# EAGLE design synth-zodiac-scorpio-kbd (EAGLE 9.6.2)
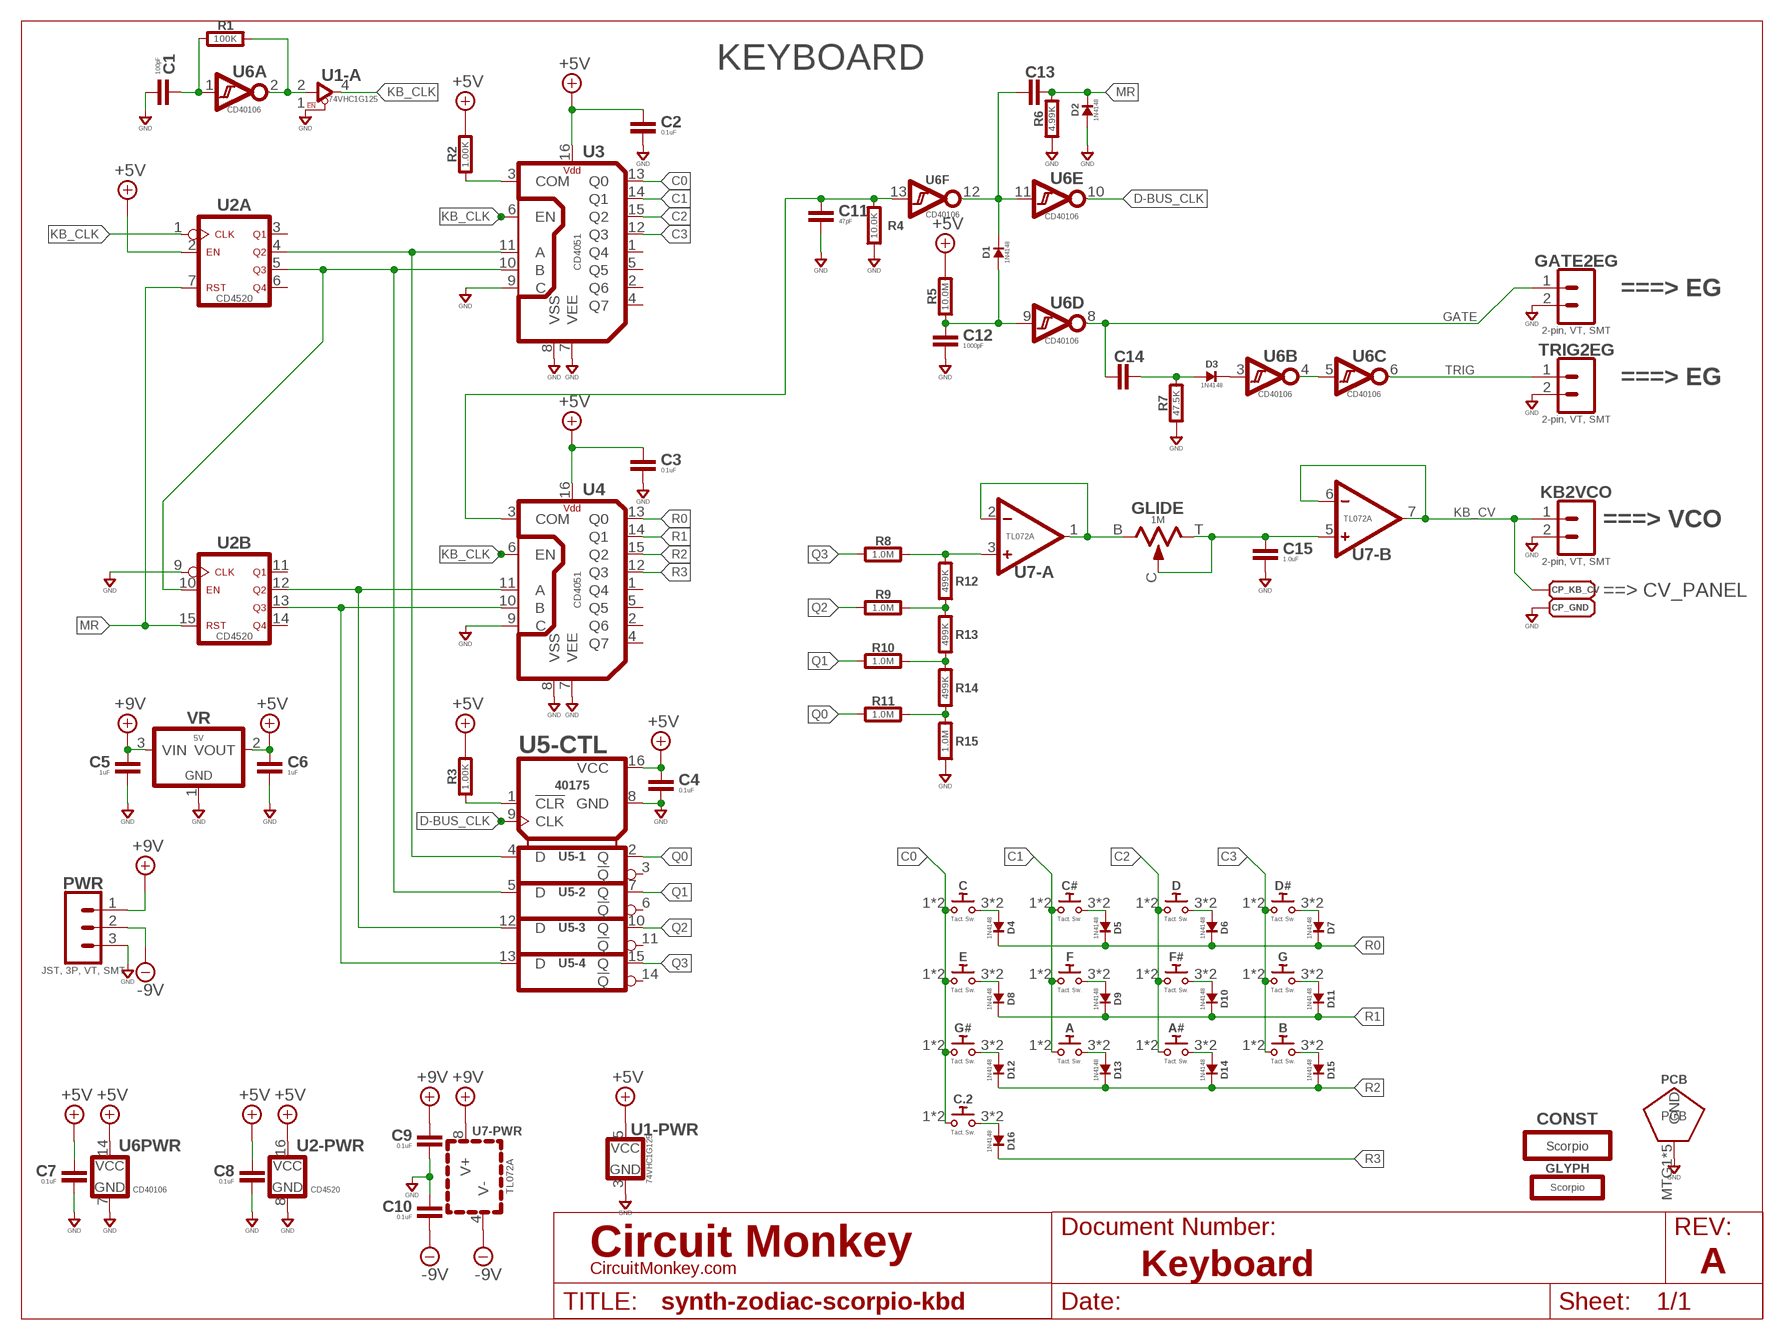
[diagram p0: schematic, sheet 1]
SHEET4 (LETTER_L-CIRCUITMONKEY): DOCUMENT_NUMBER: Keyboard; REV: A

## Parts
A  Tact. Sw.  PUSHBTN-MOMB3FS  [B3FS]
A#  Tact. Sw.  PUSHBTN-MOMB3FS  [B3FS]
B  Tact. Sw.  PUSHBTN-MOMB3FS  [B3FS]
C  Tact. Sw.  PUSHBTN-MOMB3FS  [B3FS]
C1  100pF  CAPACITOR0603  [0603-CAP]
C2  0.1uF  CAPACITOR0603  [0603-CAP]
C3  0.1uF  CAPACITOR0603  [0603-CAP]
C4  0.1uF  CAPACITOR0603  [0603-CAP]
C5  1uF  CAPACITOR0603  [0603-CAP]
C6  1uF  CAPACITOR0603  [0603-CAP]
C7  0.1uF  CAPACITOR0603  [0603-CAP]
C8  0.1uF  CAPACITOR0603  [0603-CAP]
C9  0.1uF  CAPACITOR0603  [0603-CAP]
C10  0.1uF  CAPACITOR0603  [0603-CAP]
C11  47pF  CAPACITOR0603  [0603-CAP]
C12  1000pF  CAPACITOR0603  [0603-CAP]
C13  220pF  CAPACITOR0603  [0603-CAP]
C14  0.1uF  CAPACITOR0603  [0603-CAP]
C15  1.0uF  CAPACITOR0603  [0603-CAP]
C#  Tact. Sw.  PUSHBTN-MOMB3FS  [B3FS]
C.2  Tact. Sw.  PUSHBTN-MOMB3FS  [B3FS]
CONST  Scorpio  CONSTELLATION-SCORPIO  [SCORPIO-CONST]
CP_GND  PAD-70X70SMD-070X070  [SMD-070MIL]
CP_KB_CV  PAD-70X70SMD-070X070  [SMD-070MIL]
D  Tact. Sw.  PUSHBTN-MOMB3FS  [B3FS]
D1  1N4148  DIODE-1N4148  [SOD-123]
D2  1N4148  DIODE-1N4148  [SOD-123]
D3  1N4148  DIODE-1N4148  [SOD-123]
D4  1N4148  DIODE-1N4148  [SOD-123]
D5  1N4148  DIODE-1N4148  [SOD-123]
D6  1N4148  DIODE-1N4148  [SOD-123]
D7  1N4148  DIODE-1N4148  [SOD-123]
D8  1N4148  DIODE-1N4148  [SOD-123]
D9  1N4148  DIODE-1N4148  [SOD-123]
D10  1N4148  DIODE-1N4148  [SOD-123]
D11  1N4148  DIODE-1N4148  [SOD-123]
D12  1N4148  DIODE-1N4148  [SOD-123]
D13  1N4148  DIODE-1N4148  [SOD-123]
D14  1N4148  DIODE-1N4148  [SOD-123]
D15  1N4148  DIODE-1N4148  [SOD-123]
D16  1N4148  DIODE-1N4148  [SOD-123]
D#  Tact. Sw.  PUSHBTN-MOMB3FS  [B3FS]
E  Tact. Sw.  PUSHBTN-MOMB3FS  [B3FS]
F  Tact. Sw.  PUSHBTN-MOMB3FS  [B3FS]
F#  Tact. Sw.  PUSHBTN-MOMB3FS  [B3FS]
G  Tact. Sw.  PUSHBTN-MOMB3FS  [B3FS]
G#  Tact. Sw.  PUSHBTN-MOMB3FS  [B3FS]
GATE2EG  2-pin, VT, SMT  02PVT-SMT  [B2B-PH-SM4]
GLIDE  1M  TRIMPOT9MM_PCB_SHAFT  [POT-RV9110]
GLYPH  Scorpio  GLYPH-SCORPIO  [SCORPIO-GLYPH]
KB2VCO  2-pin, VT, SMT  02PVT-SMT  [B2B-PH-SM4]
PCB  PCB FAB  PENTAGON-40R  [PENTAGON-40MM-RAD]
PWR  JST, 3P, VT, SMT  03P-VT-SMT  [B3B-PH-SM4]
R1  100K  RESISTOR0603  [0603-RES]
R2  1.00K  RESISTOR0603  [0603-RES]
R3  1.00K  RESISTOR0603  [0603-RES]
R4  10.0K  RESISTOR0603  [0603-RES]
R5  10.0M  RESISTOR0603  [0603-RES]
R6  4.99K  RESISTOR0603  [0603-RES]
R7  47.5K  RESISTOR0603  [0603-RES]
R8  1.0M  RESISTOR0603  [0603-RES]
R9  1.0M  RESISTOR0603  [0603-RES]
R10  1.0M  RESISTOR0603  [0603-RES]
R11  1.0M  RESISTOR0603  [0603-RES]
R12  499K  RESISTOR0603  [0603-RES]
R13  499K  RESISTOR0603  [0603-RES]
R14  499K  RESISTOR0603  [0603-RES]
R15  1.0M  RESISTOR0603  [0603-RES]
TRIG2EG  2-pin, VT, SMT  02PVT-SMT  [B2B-PH-SM4]
U1  74VHC1G125  74VHC1G125CMOS-SOT553  [TSOP-5]
U2  CD4520  [SO16]
U3  CD4051  CD4051SO-D  [SO16]
U4  CD4051  CD4051SO-D  [SO16]
U5  40175  CD40175SMT-D-TYPE  [SO16]
U6  CD40106  CD40106-SOP14  [SOP14]
U7  TL072A  DUALTL072A  [SOP08]
VR  5V  LDO-3P--5V-SOT23  [SOT-23]

## Nets
+5V: C2.1 C3.1 C4.1 C6.1 C7.1 C8.1 R2.2 R3.2 R5.2 U1.5(-PWR:VCC) U2.2(A:EN) U2.16(-PWR:VCC) U3.16(VDD) U4.16(VDD) U5.16(-CTL:VCC) U6.14(PWR:VCC) VR.2(VOUT)
+9V: C5.1 C9.1 PWR.1 U7.8(-PWR:V+) VR.3(VIN)
-9V: C10.2 PWR.2 U7.4(-PWR:V-)
C0: C.1 C.2 C.2.1 C.2.2 E.1 E.2 G#.1 G#.2 U3.13(Q0)
C1: A.1 A.2 C#.1 C#.2 F.1 F.2 U3.14(Q1)
C2: A#.1 A#.2 D.1 D.2 F#.1 F#.2 U3.15(Q2)
C3: B.1 B.2 D#.1 D#.2 G.1 G.2 U3.12(Q3)
D-BUS_CLK: U5.9(-CTL:CLK) U6.10(E:Y)
GATE: C14.1 GATE2EG.1 U6.8(D:Y)
GND: C1.2 C2.2 C3.2 C4.2 C5.2 C6.2 C7.2 C8.2 C9.2 C10.1 C11.2 C12.2 C15.2 CP_GND.1(PAD) D2.A GATE2EG.2 KB2VCO.2 PCB.MTG1(GND) PCB.MTG2(GND) PCB.MTG3(GND) PCB.MTG4(GND) PCB.MTG5(GND) PWR.3 R4.1 R6.1 R7.1 R15.1 TRIG2EG.2 U1.1(-A:!EN) U1.3(-PWR:GND) U2.8(-PWR:GND) U2.9(B:!CLK) U3.7(VEE) U3.8(VSS) U3.9(C) U4.7(VEE) U4.8(VSS) U4.9(C) U5.8(-CTL:GND) U6.7(PWR:GND) VR.1(GND)
KB_CLK: U1.4(-A:Y) U2.1(A:!CLK) U3.6(EN) U4.6(EN)
KB_CV: CP_KB_CV.1(PAD) KB2VCO.1 U7.6(-B:-) U7.7(-B:OUT)
MR: C13.2 D2.K R6.2 U2.7(A:RST) U2.15(B:RST)
N$78: R2.1 U3.3(COM)
N$102: C12.1 D1.A R5.1 U6.9(D:A)
N$103: R3.1 U5.1(-CTL:!CLR)
N$104: U6.4(B:Y) U6.5(C:A)
N$105: U2.12(B:Q2) U4.11(A) U5.12(-3:D)
N$106: U2.13(B:Q3) U4.10(B) U5.13(-4:D)
N$107: C1.1 R1.1 U6.1(A:A)
N$108: R1.2 U1.2(-A:A) U6.2(A:Y)
N$109: U2.4(A:Q2) U3.11(A) U5.4(-1:D)
N$110: U2.5(A:Q3) U2.10(B:EN) U3.10(B) U5.5(-2:D)
N$111: R11.2 R14.1 R15.2
N$112: C13.1 D1.K U6.11(E:A) U6.12(F:Y)
N$113: R10.2 R13.1 R14.2
N$114: D3.K U6.3(B:A)
N$115: C14.2 D3.A R7.2
N$116: C11.1 R4.2 U4.3(COM) U6.13(F:A)
N$117: R9.2 R12.1 R13.2
N$118: R8.2 R12.2 U7.3(-A:+)
N$119: GLIDE.B U7.1(-A:OUT) U7.2(-A:-)
N$120: C.3 C.4 D4.A
N$121: C15.1 GLIDE.C GLIDE.T U7.5(-B:+)
N$122: C#.3 C#.4 D5.A
N$123: D6.A D.3 D.4
N$124: D7.A D#.3 D#.4
N$125: D8.A E.3 E.4
N$126: D9.A F.3 F.4
N$127: D10.A F#.3 F#.4
N$128: D11.A G.3 G.4
N$129: D12.A G#.3 G#.4
N$130: A.3 A.4 D13.A
N$131: A#.3 A#.4 D14.A
N$132: B.3 B.4 D15.A
N$133: C.2.3 C.2.4 D16.A
Q0: R11.1 U5.2(-1:Q)
Q1: R10.1 U5.7(-2:Q)
Q2: R9.1 U5.10(-3:Q)
Q3: R8.1 U5.15(-4:Q)
R0: D4.K D5.K D6.K D7.K U4.13(Q0)
R1: D8.K D9.K D10.K D11.K U4.14(Q1)
R2: D12.K D13.K D14.K D15.K U4.15(Q2)
R3: D16.K U4.12(Q3)
TRIG: TRIG2EG.1 U6.6(C:Y)
Unconnected: U2.3(A:Q1) U2.6(A:Q4) U2.11(B:Q1) U2.14(B:Q4) U3.1(Q4) U3.2(Q6) U3.4(Q7) U3.5(Q5) U4.1(Q4) U4.2(Q6) U4.4(Q7) U4.5(Q5) U5.3(-1:!Q) U5.6(-2:!Q) U5.11(-3:!Q) U5.14(-4:!Q)

## Notes on the sheet
- KEYBOARD
- ===> EG
- ===> EG
- ===> VCO
- ==> CV_PANEL

## Library data of the parts
A A# B C C# C.2 D D# E F F# G G# = switch-smd:PUSHBTN-MOM: Pushbutton Switch; MFR: Omron; MPN: B3FS-10*
C1-C15 = rlc:CAPACITOR: Capacitor; COST01: 0.12; COST10: 0.09; COST100: 0.05
CONST = circuit-monkey-zodiac:CONSTELLATION: Constellations
CP_GND CP_KB_CV = con-testpoints:PAD-70X70: Solder Pad
D1-D16 = diodes:DIODE-: Diode; COST01: 0.20; COST10: 0.18; COST100: 0.10; MPN: 1N4148W
GATE2EG KB2VCO TRIG2EG = con-jst:02P: 2 pin connector; COST01: 0.76; COST10: 0.66; COST100: 0.56; MFR: JST; MPN: B2B-PH-SM4
GLIDE = rlc:TRIMPOT: Potentiometer; COST01: 0.70; COST10: 0.60; COST100: 0.60; MFR: Tayda; MPN: RV9110NO-OS15A00; SKU: A-5517
GLYPH = circuit-monkey-zodiac:GLYPH: Glyph
PCB = circuit-monkey-zodiac:PENTAGON: Pentagram shaped PCB
PWR = con-jst:03P: 3 pin connector; COST01: 0.60; COST10: 0.52; COST100: 0.43; MFR: JST; MPN: B3B-PH-SM4
R1-R15 = rlc:RESISTOR: Resistor; COST01: 0.10; COST10: 0.05; COST100: 0.02
U1 = logic:74VHC1G*125: Single Gate Buffer with Enable; COST01: 0.50; COST10: 0.40; COST100: 0.30; MFR: ON Semi; MPN: MC74VHC1G125P5TG
U2 = logic:CD4520: Up Counter, 4-bit, Dual; COST01: 0.60; COST10: 0.50; COST100: 0.35; MFR: TI; MPN: CD4520BM96
U3 U4 = logic:CD4051: 8-channel, Multiplexer/Demultiplexer; COST01: 0.70; COST10: 0.60; COST100: 0.40; MFR: TI; MPN: CD4051BM
U5 = logic:CD40175: Quad D-type Flip Flop; COST01: 0.60; COST10: 0.50; COST100: 0.37; MFR: TI; MPN: CD40175BM
U6 = logic:CD40106: Hex Inverting Schmidt Trigger Buffer; COST01: 0.64; COST10: 0.54; COST100: 0.39; MFR: TI; MPN: CD40106BM
U7 = op-amp:DUAL: Dual Op-Amp; COST01: 0.65; COST10: 0.55; COST100: 0.45; MFR: ST; MPN: TL072A
VR = regulators:LDO-3P-: regulator 3-pin; COST01: 0.66; COST10: 0.56; COST100: 0.39; MFR: Diodes, Inc.; MPN: AP7387-50SA

## Board
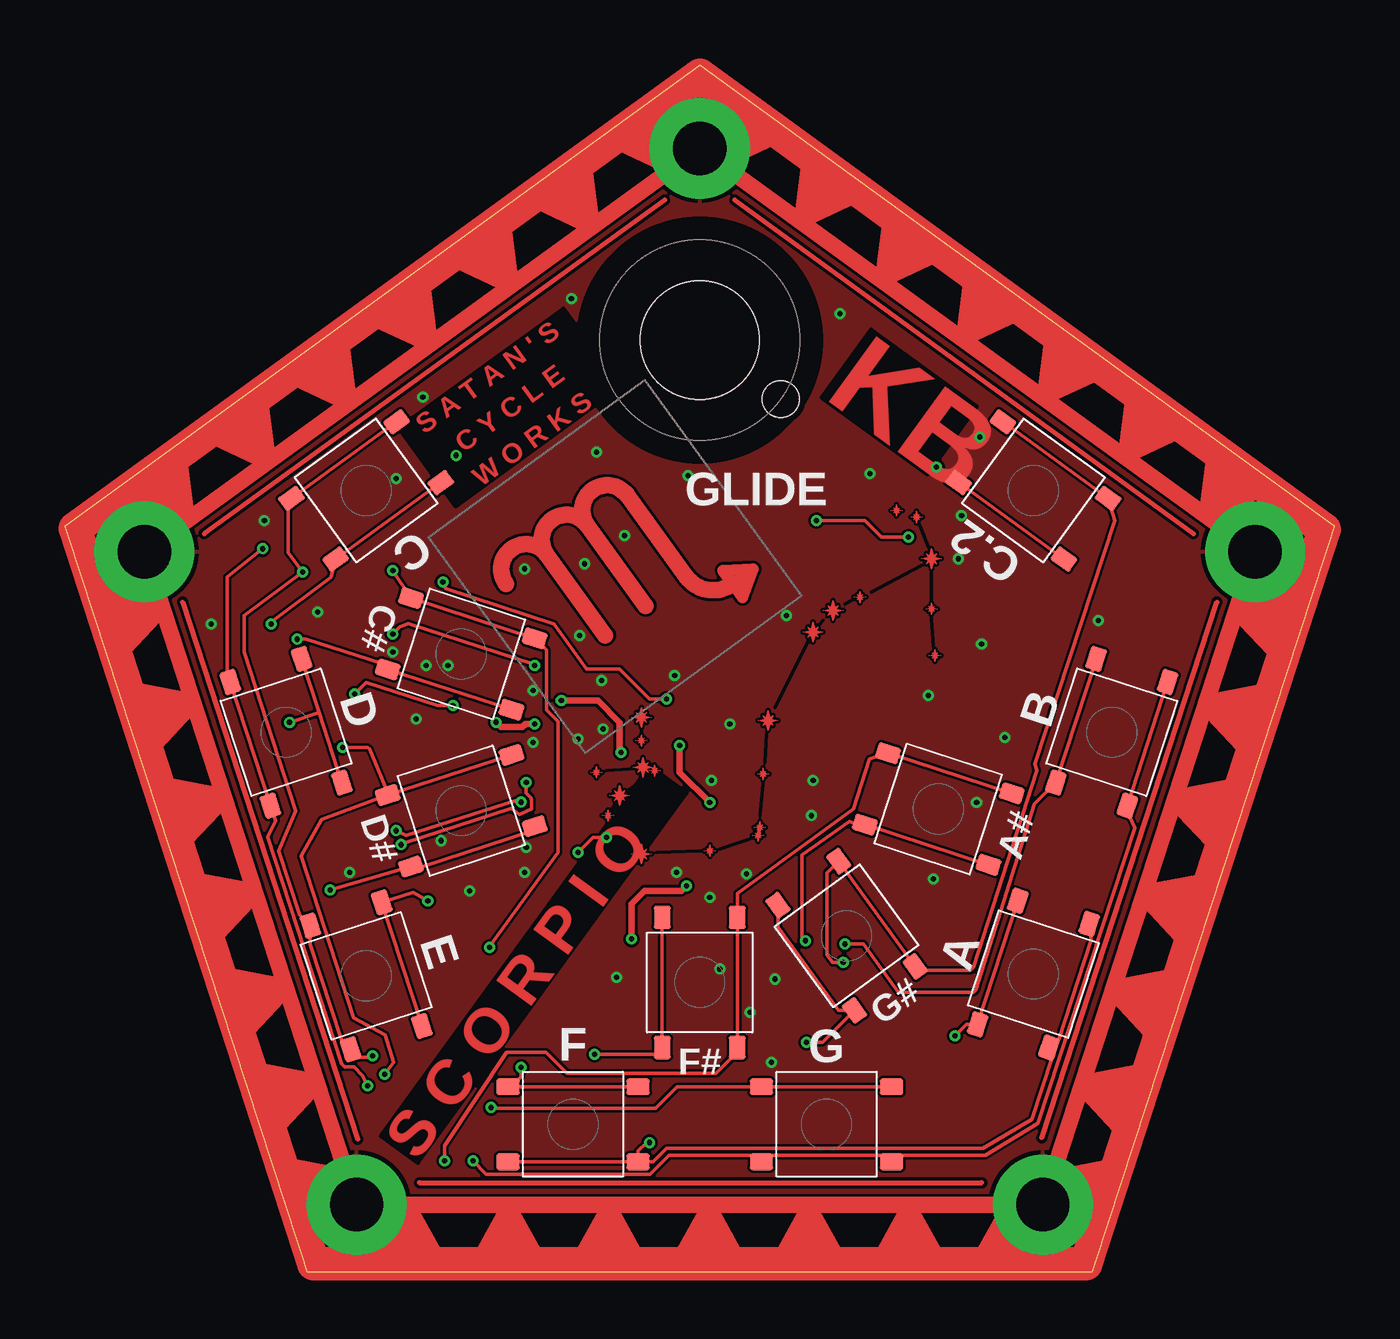
[diagram p1: board, top side]
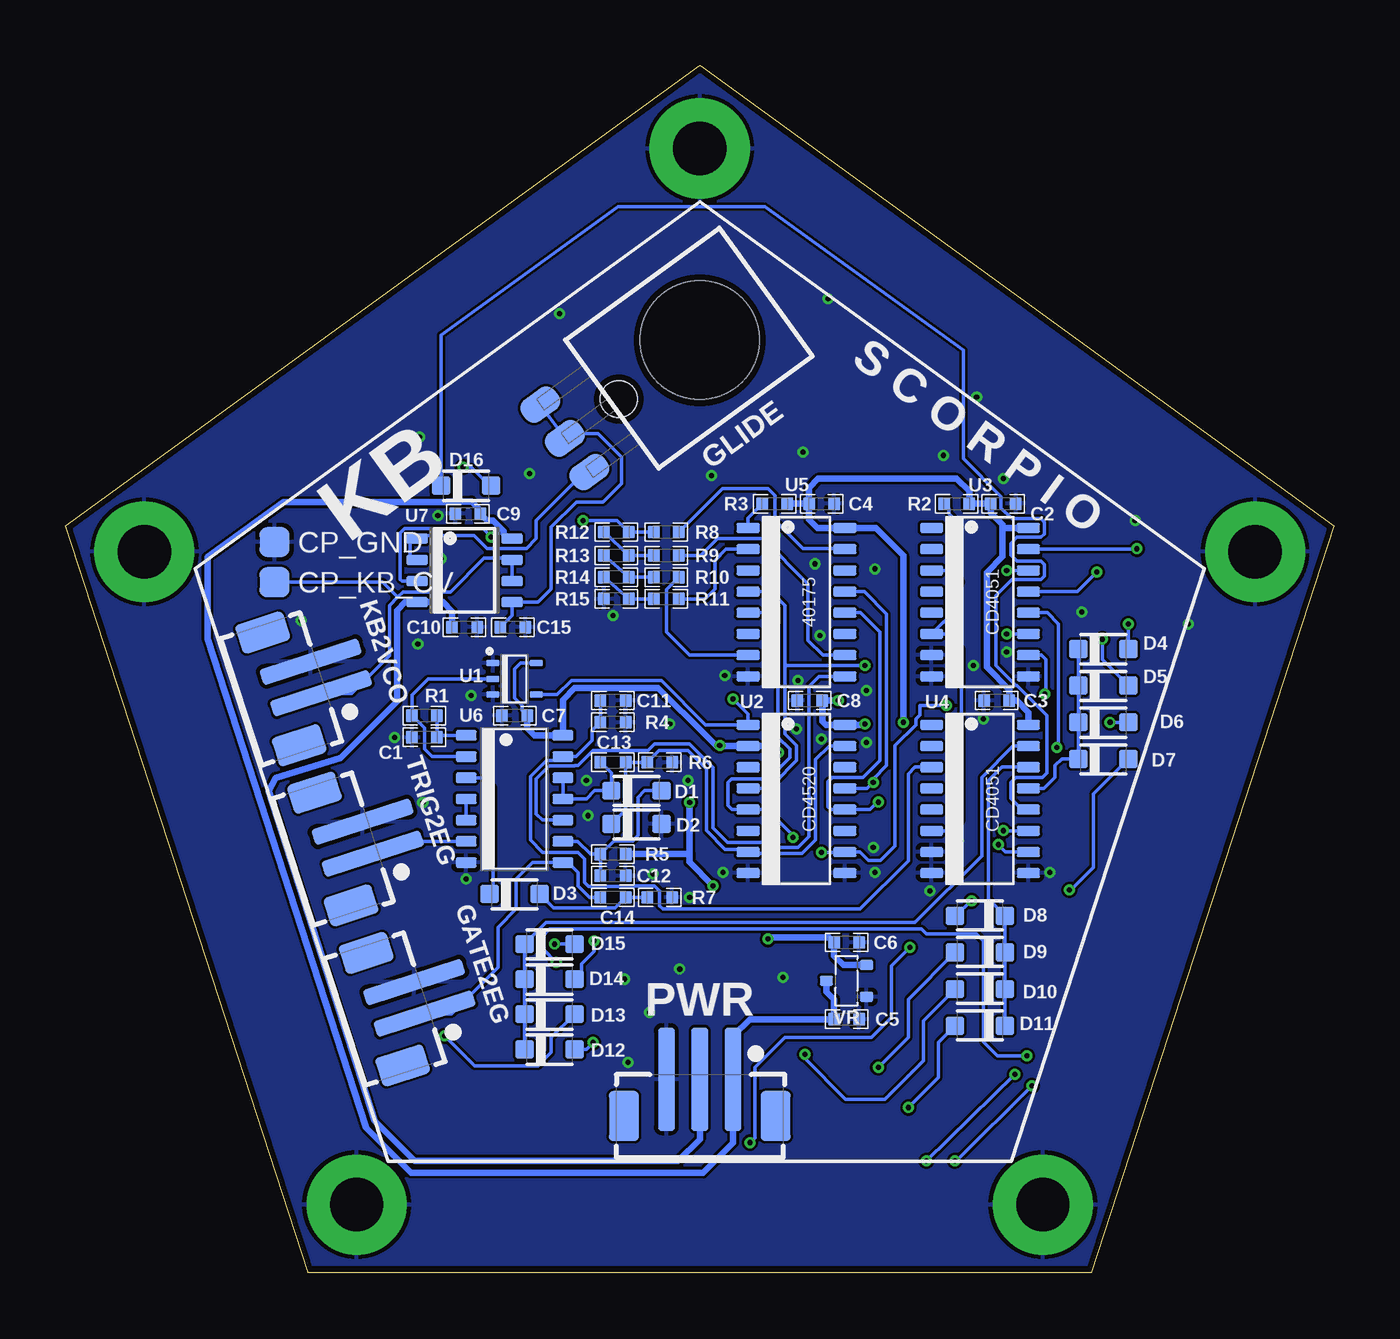
[diagram p2: board, bottom side, seen from below]

Size 76.08 x 72.36 mm. Coordinates in mm from the lower left corner, seen from the top.
Copper layers (1*16): Top 0.0356mm / dielectric 1.5011mm / Bottom 0.0356mm
Design rules "OSH-CircuitMonkey *": minimum track width 6mil, minimum drill 12mil, track to track 6mil, track to pad 6mil, pad to pad 6mil, via to via 6mil, smd to smd 6mil, copper to edge 15mil, drill to drill 6mil, minimum pad ring 7mil, minimum via ring 7mil, stop-mask expansion 3mil, vias tented up to drill 15mil, thermal gap 10mil

### Footprints (pad centres in the part's own frame; a part is rotated, then mirrored left to right if it is on the bottom)
B3FS = smd 1.4 x 1: 1 3.9,-2.25; 2 -3.9,-2.25; 3 3.9,2.25; 4 -3.9,2.25
0603-CAP = smd 0.711 x 0.762: 1 -0.752,0; 2 0.752,0
SMD-070MIL = smd 1.778 x 1.778: 1 0.508,0
SOD-123 = smd 1.1 x 1.1: A 1.5,0; K -1.5,0
B2B-PH-SM4 = smd 1 x 6.2: 1 -1,-2.2; 2 1,-2.2 | smd 1.8 x 3: GND@MT1 3.55,0; GND@MT2 -3.55,0
POT-RV9110 = smd 1.6 x 2.4: B 2.5,-10; C 0,-10; T -2.5,-10 | hole 7.1: 0,0 | hole 2.2: 0,-6
PENTAGON-40MM-RAD = drill 3.2 pad 6: MTG1 0,35; MTG2 33.3,10.82; MTG3 20.57,-28.32; MTG4 -20.57,-28.32; MTG5 -33.3,10.82
B3B-PH-SM4 = smd 1 x 6.2: 1 -2,-2.2; 2 0,-2.2; 3 2,-2.2 | smd 1.8 x 3: GND@MT1 4.55,0; GND@MT2 -4.55,0
0603-RES = smd 0.711 x 0.762: 1 -0.752,0; 2 0.752,0
TSOP-5 = smd 0.4 x 0.8: 1 -0.95,-1.3; 2 0,-1.3; 3 0.95,-1.3; 4 0.95,1.3; 5 -0.95,1.3
SO16 = smd 0.6 x 1.4: 1 -4.445,-2.9; 2 -3.175,-2.9; 3 -1.905,-2.9; 4 -0.635,-2.9; 5 0.635,-2.9; 6 1.905,-2.9; 7 3.175,-2.9; 8 4.445,-2.9; 9 4.445,2.9; 10 3.175,2.9; 11 1.905,2.9; 12 0.635,2.9; 13 -0.635,2.9; 14 -1.905,2.9; 15 -3.175,2.9; 16 -4.445,2.9
SOP14 = smd 1.27 x 0.635: 1 -2.9,3.81; 2 -2.9,2.54; 3 -2.9,1.27; 4 -2.9,0; 5 -2.9,-1.27; 6 -2.9,-2.54; 7 -2.9,-3.81; 8 2.9,-3.81; 9 2.9,-2.54; 10 2.9,-1.27; 11 2.9,0; 12 2.9,1.27; 13 2.9,2.54; 14 2.9,3.81
SOP08 = smd 0.6 x 1.3: 1 -1.905,-2.85; 2 -0.635,-2.85; 3 0.635,-2.85; 4 1.905,-2.85; 5 1.905,2.85; 6 0.635,2.85; 7 -0.635,2.85; 8 -1.905,2.85
SOT-23 = smd 0.6 x 0.8: 1 0.95,1.2; 2 -0.95,1.2; 3 0,-1.2

### Placement (x,y rotation side)
A  58.04,17.86 72 top
A#  52.34,27.76 162 top
B  62.74,32.36 72 top
C  18.04,46.86 216 top
C1  54.54,32.06 180 bottom
C2  19.84,46.06 0 bottom
C3  20.24,34.26 180 bottom
C4  30.74,46.06 0 bottom
C5  29.24,15.16 0 bottom
C6  29.24,19.76 0 bottom
C7  49.14,33.36 180 bottom
C8  31.44,34.26 180 bottom
C9  51.94,45.46 180 bottom
C10  52.14,38.66 180 bottom
C11  43.24,34.26 0 bottom
C12  43.24,23.76 0 bottom
C13  43.24,30.56 0 bottom
C14  43.24,22.46 0 bottom
C15  49.24,38.66 0 bottom
C#  23.74,37.06 162 top
C.2  58.04,46.86 144 top
CONST  43.04,38.36 90 top
CP_GND  64.04,43.76 0 bottom
CP_KB_CV  64.04,41.36 0 bottom
D  13.24,32.36 288 top
D1  41.84,28.86 0 bottom
D2  41.84,26.86 0 bottom
D3  49.14,22.66 0 bottom
D4  13.84,37.36 0 bottom
D5  13.84,35.16 0 bottom
D6  13.84,32.96 0 bottom
D7  13.84,30.76 0 bottom
D8  21.24,21.36 180 bottom
D9  21.24,19.16 180 bottom
D10  21.24,16.96 180 bottom
D11  21.24,14.76 180 bottom
D12  47.04,13.36 0 bottom
D13  47.04,15.46 0 bottom
D14  47.04,17.56 0 bottom
D15  47.04,19.66 0 bottom
D16  52.04,47.16 0 bottom
D#  23.74,27.66 198 top
E  18.04,17.76 288 top
F  30.44,8.86 0 top
F#  38.04,17.36 90 top
G  45.64,8.86 0 top
G#  46.84,20.16 126 top
GATE2EG  56.94,15.76 108 bottom
GLIDE  38.04,55.86 306 bottom
GLYPH  33.04,42.36 36 top
KB2VCO  63.14,34.96 108 bottom
PCB  38.04,32.36 0 top
PWR  38.04,9.36 180 bottom
R1  54.54,33.36 180 bottom
R2  22.64,46.06 0 bottom
R3  33.54,46.06 0 bottom
R4  43.24,32.96 180 bottom
R5  43.24,25.06 0 bottom
R6  40.44,30.56 180 bottom
R7  40.44,22.46 180 bottom
R8  40.04,44.36 180 bottom
R9  40.04,42.96 180 bottom
R10  40.04,41.66 180 bottom
R11  40.04,40.36 180 bottom
R12  43.04,44.36 0 bottom
R13  43.04,42.96 0 bottom
R14  43.04,41.66 0 bottom
R15  43.04,40.36 0 bottom
TRIG2EG  60.04,25.36 108 bottom
U1  49.14,35.56 270 bottom
U2  32.24,28.36 270 bottom
U3  21.24,40.16 270 bottom
U4  21.24,28.36 270 bottom
U5  32.24,40.16 270 bottom
U6  49.14,28.36 0 bottom
U7  52.14,42.06 270 bottom
VR  29.24,17.46 270 bottom

### Tracks (layer width: path | path; a pad name or v marks a point on that pad's centre or on a via)
+5V  (via drill 0.3)
  Top 0.4: v37.24,23.16 36.94,22.86 34.74,22.86 33.94,22.06 v33.94,19.96 | v29.74,34.26 31.94,34.26 33.24,32.96 33.24,31.24 v33.33,31.16 | v28.14,32.86 27.59,32.86 27.4,32.67 26.13,32.67 v25.84,32.96 | v38.64,28.16 36.84,29.96 v36.84,31.56
  Bottom 0.2: U1.5 48.79,36.51 49.14,36.16 49.14,34.41 48.69,33.96 48.69,33.66 C7.1
  Bottom 0.4: C4.1 31.49,45.11 30.99,44.61 U5.16 27.49,44.61 25.84,42.96 v25.84,32.96 | R3.2 C4.1 | U4.16 18.34,33.56 19.04,34.26 C3.1 19.49,34.91 20.84,36.26 20.84,41.95 19.89,42.91 19.89,44.56 | C7.1 48.39,32.61 47.95,32.17 U6.14 46.24,34.31 45.54,35.01 40.53,35.01 37.67,32.15 37.66,32.15 37.04,31.54 U2.2 | C4.1 31.49,47.01 30.94,47.56 22.64,47.56 21.89,46.81 R2.2 C2.1 20.59,45.51 19.89,44.81 19.89,44.56 | v36.84,31.56 36.82,31.54 U2.2 | R5.2 38.66,25.06 | 38.66,25.06 38.66,24.58 v37.24,23.16 | v29.74,34.26 C8.1 30.69,33.01 30.49,32.81 U2.16 28.2,32.81 v28.14,32.86 | U2.2 34.1,31.54 33.73,31.16 v33.33,31.16 | 38.66,25.06 38.64,25.08 v38.64,28.16 | U3.16 19.84,44.61 19.89,44.56 | VR.2 29.44,18.41 29.99,18.96 C6.1 30.29,20.06 33.84,20.06 v33.94,19.96
+9V
  Bottom 0.4: U7.8 49.49,43.97 49.79,44.27 49.79,44.41 50.44,45.06 50.79,45.06 C9.1 51.19,45.66 51.72,46.19 53.15,46.19 53.19,46.16 62.99,46.16 67.54,42.86 67.54,37.96 58.04,8.66 55.34,5.96 37.84,5.96 36.04,7.76 PWR.1 36.04,14.16 35.04,15.16 C5.1 29.99,16.36 30.44,16.81 VR.3
-9V
  Bottom 0.4: C10.2 52.89,39.61 53.44,40.16 U7.4 55.69,40.16 56.19,39.66 56.19,34.21 59.56,30.83 63.47,29.63 63.88,28.83 57.54,9.06 55.14,6.66 39.34,6.66 38.04,7.96 PWR.2
C0  (via drill 0.3)
  Top 0.2: C.2.1 C.2.2 62.94,45.06 58.14,30.46 58.24,30.06 54.44,18.26 54.26,18.08 51.2,18.08 G#.2 G#.1 45.67,23.94 45.67,19 46.01,18.56 v46.64,18.56 | C.2 C.1 13.36,46.19 13.36,43.14 v14.24,41.96 10.74,39.36 10.74,37.18 13.82,27.64 12.8,25.25 14.06,21.42 E.2 14.7,19.65 16.57,13.9 E.1 17.6,12.86 18.34,12.86 v18.44,12.96
  Bottom 0.2: U3.13 15.41,40.8 v14.24,41.96 | v46.64,18.56 47.44,19.36 47.44,20.16 47.04,20.56 24.74,20.56 24.44,20.26 21.44,20.26 21.04,19.86 21.04,13.81 20.19,12.96 v18.44,12.96
C1  (via drill 0.3)
  Top 0.2: A.1 61.49,20.77 61.49,19.85 59.57,13.95 59.08,13.46 A.2 59.18,13.26 59.18,12.9 57.94,9.16 55.02,7.41 36.04,7.41 35.24,6.61 F.1 | F.1 F.2 | v19.64,42.06 C#.1 C#.2 28.85,37.3 28.85,33.7 29.54,33 29.54,25.16 25.45,19.54 25.44,19.53 v25.44,19.46 | v35.04,7.76 34.84,7.76 34.34,7.26 F.1
  Bottom 0.2: U3.14 v19.64,42.06 | v25.44,19.46 26.54,18.36 26.54,15.26 27.74,14.06 32.94,14.06 34.74,12.26 34.74,8.06 v35.04,7.76
C2  (via drill 0.3)
  Top 0.2: A#.2 A#.1 48.2,30.76 47.25,27.77 40.29,22.71 F#.1 F#.2 40.29,13.19 39.01,11.91 30.09,11.91 28.84,13.16 26.45,13.16 22.74,7.58 v22.74,6.66 | v11.84,43.36 9.7,41.66 9.7,35.57 D.2 D.1 12.62,27.03 12.15,26.09 16.57,12.49 16.77,12.29 17.31,12.29 17.84,11.76 v18.14,11.16
  Bottom 0.2: U3.15 11.87,43.34 v11.84,43.36 | v18.14,11.16 22.64,6.66 v22.74,6.66
C3  (via drill 0.3)
  Top 0.2: B.1 B.2 63.68,27.63 64.11,26.62 58.3,8.92 55.15,7.01 49.94,7.01 G.1 49.14,7.01 42.14,7.01 G.2 41.34,7.01 36.21,7.01 35.06,5.86 25.24,5.86 v24.44,6.66 | D#.2 D#.1 | v19.14,11.86 19.69,12.56 19.19,14.23 17.3,15.23 14.14,24.95 15.38,27.14 D#.1 | v16.64,31.46 18.14,31.46 18.24,31.36 19.34,28.76 D#.1
  Bottom 0.2: v24.44,6.66 v19.14,11.86 | U3.12 17.21,39.53 16.54,38.86 16.54,31.56 v16.64,31.46
D-BUS_CLK
  Bottom 0.2: U6.10 47.47,27.09 47.84,27.46 47.84,29.56 47.07,30.33 45.56,30.33 45.53,30.36 45.34,30.36 44.44,31.26 41.14,31.26 40.74,31.66 38.64,31.66 37.24,30.26 37.24,26.62 36.38,25.76 34.24,25.76 33.94,25.46 32.14,25.46 31.49,26.11 31.49,35.11 30.89,35.72 U5.9
GATE
  Bottom 0.2: GATE2EG.1 52.91,15.49 50.14,18.26 50.14,20.66 49.04,21.76 49.04,23.56 48.05,24.55 U6.8 45.93,24.55 45.34,23.96 45.34,23.16 44.64,22.46 C14.1
GND  (via drill 0.3)
  other vias: 38.74,29.46 39.84,32.86 38.64,22.46 22.94,36.36 21.64,36.36 21.04,33.16 53.74,45.36 53.54,42.76 54.94,37.66 51.74,34.56 56.34,32.06 61.94,39.06 43.24,39.36 36.54,35.76 32.14,35.46 32.24,32.56 36.64,23.96 27.54,23.96 24.24,22.86 22.54,25.86 17.04,23.96 19.64,37.16 15.14,39.56 19.84,47.56 11.94,45.06 8.74,38.86 23.44,48.96 46.44,57.46 48.24,47.86 30.34,58.36 31.84,49.16 37.34,47.76 54.84,50.06 21.44,52.46 40.84,23.86 52.04,23.56 54.64,28.16 44.74,27.36 44.84,29.46 27.54,42.16 31.14,42.46 33.54,44.16 30.84,38.16 28.04,34.86 30.74,31.96 28.04,31.76 27.64,25.46 42.54,17.56 33.04,17.66 39.24,18.16 41.04,15.56 42.34,12.56
  pour Top (rank 4): 17.44,3.96 58.64,3.96 71.44,43.16 38.04,67.56 4.64,43.16
  pour Bottom: 14.64,0.16 61.44,0.16 75.84,44.56 75.84,44.76 38.04,72.16 0.24,44.76 0.24,44.36
KB_CLK  (via drill 0.3)
  Top 0.2: v36.04,34.36 35.04,34.36 33.24,36.16 31.26,36.16 29.31,38.84 22.82,40.99 v22.64,41.36
  Bottom 0.2: U4.6 22.95,26.46 22.34,27.06 22.34,37.36 23.24,38.26 U3.6 23.42,38.97 23.39,38.97 23.19,39.17 23.19,40.81 v22.64,41.36 | U1.4 46.59,34.61 45.74,35.46 40.34,35.46 37.69,32.81 U2.1 35.14,33.46 v36.04,34.36
KB_CV
  Bottom 0.2: KB2VCO.1 58.91,34.69 56.64,36.96 56.64,39.96 56.14,40.46 | 56.14,40.46 55.83,40.77 52.99,40.77 50.97,42.8 49.39,42.8 U7.7 U7.6 | CP_KB_CV.1 57.04,41.36 56.14,40.46
MR
  Bottom 0.2: D2.K 42.49,27.71 C13.2 R6.2 40.49,31.26 38.74,31.26 37.64,30.16 37.64,26.46 36.52,25.34 35.29,25.34 U2.7 35.04,25.09 31.92,25.09 31.09,25.91 31.09,30.72 30.28,31.54 U2.15
N$78
  Bottom 0.2: U3.3 23.24,42.07 22.64,42.66 22.64,45.01 23.09,45.46 23.09,45.76 R2.1
N$102
  Bottom 0.2: R5.1 44.59,25.06 45.35,25.82 U6.9 | C12.1 R5.1 | D1.A 41.34,28.86 41.74,28.46 41.74,26.16 42.04,25.86 43.19,25.86 R5.1
N$103
  Bottom 0.2: R3.1 35.14,45.21 U5.1
N$104
  Bottom 0.2: U6.4 U6.5
N$105  (via drill 0.3)
  Top 0.2: v19.84,26.46 20.43,26.16 27.03,28.27 v27.34,28.17
  Bottom 0.2: U5.12 28.41,39.53 27.24,38.36 27.24,30.66 28.26,29.65 30.09,29.65 30.34,29.4 30.34,27.89 30.18,27.73 U2.12 27.84,27.73 27.4,28.17 v27.34,28.17 | U4.11 v19.84,26.46
N$106  (via drill 0.3)
  Top 0.2: v27.64,29.36 27.64,28.71 27.93,28.42 27.93,28.34 27.94,28.41 27.97,28.29 27.97,27.76 27.24,27.43 26.72,27.79 20.36,25.73 20.3,25.62 v20.14,25.62
  Bottom 0.2: U5.13 28.18,40.8 26.84,39.46 26.84,30.36 27.64,29.56 v27.64,29.36 28.01,29 U2.13 | U4.10 19.71,25.19 v20.14,25.62
N$107
  Bottom 0.2: R1.1 C1.1 53.68,32.17 U6.1
N$108
  Bottom 0.2: U6.2 54.08,30.9 54.54,31.36 54.54,32.61 R1.2 55.29,34.61 54.34,35.56 U1.2
N$109  (via drill 0.3)
  Top 0.2: v19.64,38.26 20.04,38.66 20.57,38.87 28.06,36.44 v28.14,36.36
  Bottom 0.2: U5.4 33.78,40.8 32.94,39.96 32.94,36.36 | 32.94,36.36 32.94,32.26 32.24,31.56 32.24,30.66 32.84,30.06 32.94,29.96 33.91,29 U2.4 | U3.11 v19.64,38.26 | 32.94,36.36 v28.14,36.36
N$110  (via drill 0.3)
  Top 0.2: v17.34,34.66 18.04,35.36 22.33,33.96 v23.24,33.96 | v32.44,26.06 31.64,26.06 v30.74,25.16
  Bottom 0.2: U5.5 34.31,39.53 33.34,38.56 33.34,32.06 32.64,31.36 32.64,30.86 33.94,29.56 36.14,29.56 36.34,29.36 36.34,27.96 36.11,27.73 U2.5 34.01,27.73 32.44,26.16 v32.44,26.06 | v23.24,33.96 24.84,33.96 24.84,33.41 25.09,33.16 25.09,32.81 26.34,31.56 26.34,25.55 27.21,24.69 27.94,24.69 28.44,25.19 U2.10 29.37,25.16 v30.74,25.16 | U3.10 17.57,36.99 17.29,36.71 17.29,34.66 v17.34,34.66
N$111
  Bottom 0.2: R14.1 R15.2 R11.2
N$112
  Bottom 0.2: U6.12 U6.11 44.84,28.36 44.34,28.86 D1.K 43.34,29.91 C13.1
N$113
  Bottom 0.2: R13.1 R14.2 R10.2
N$114
  Bottom 0.2: D3.K 50.44,22.86 50.44,29.06 51.01,29.63 U6.3
N$115
  Bottom 0.2: R7.2 C14.2 43.12,21.83 46.81,21.83 D3.A
N$116
  Bottom 0.2: C11.1 R4.2 44.49,32.46 44.49,31.86 45.45,30.9 U6.13 46.46,30.68 47.22,30.68 48.19,29.71 48.19,25.91 47.45,25.17 45.35,25.17 44.94,24.76 44.94,23.36 44.71,23.13 42.07,23.13 42.04,23.16 40.74,23.16 40.44,22.86 40.44,21.96 40.24,21.76 28.44,21.76 25.54,24.66 25.54,29.87 25.14,30.27 U4.3
N$117
  Bottom 0.2: R12.1 R13.2 R9.2
N$118  (via drill 0.3)
  Top 0.2: v50.54,44.06 48.94,44.06 47.94,45.06 v45.04,45.06
  Bottom 0.2: R8.2 R12.2 42.99,45.06 v45.04,45.06 | v50.54,44.06 51.04,44.56 55.74,44.56 55.99,44.31 55.99,41.53 55.89,41.43 U7.3
N$119
  Bottom 0.2: U7.2 55.19,42.7 55.39,42.9 55.39,43.77 55.19,43.97 U7.1 54.8,44.16 51.58,44.16 50.78,43.36 48.44,43.36 47.84,43.96 47.84,45.06 44.94,47.96 GLIDE.B
N$120  (via drill 0.3)
  Top 0.2: C.4 C.3 15.95,41.7 15.91,41.65 12.34,38.96 v12.34,38.86
  Bottom 0.2: v12.34,38.86 D4.A
N$121
  Bottom 0.2: GLIDE.T GLIDE.C 45.85,50.26 44.14,50.26 42.74,48.86 42.74,47.26 43.84,46.16 45.44,46.16 46.94,44.66 46.94,40.96 47.75,40.16 U7.5 49.29,39.36 C15.1
N$122  (via drill 0.3)
  Top 0.2: C#.4 C#.3 19,36.47 14.43,37.94 v13.92,37.94
  Bottom 0.2: v13.92,37.94 13.92,36.74 D5.A
N$123  (via drill 0.3)
  Top 0.2: D.4 15.22,33.55 | 15.22,33.55 D.3 | v13.44,32.96 15.22,33.55
  Bottom 0.2: D6.A v13.44,32.96
N$124  (via drill 0.3)
  Top 0.2: D#.4 27.8,26.38 21.44,24.32 D#.3 v15.89,22.91
  Bottom 0.2: D7.A 14.44,28.66 14.44,24.26 15.84,22.86 v15.89,22.91
N$125  (via drill 0.3)
  Top 0.2: E.3 E.4 20.87,22.76 v21.74,22.26
  Bottom 0.2: D8.A v21.74,22.26
N$126  (via drill 0.3)
  Top 0.2: F.3 F.4 26.74,11.11 27.34,11.71 v27.34,12.26
  Bottom 0.2: D9.A 25.54,16.36 25.54,14.06 v27.34,12.26
N$127  (via drill 0.3)
  Top 0.2: F#.3 F#.4 35.39,13.06 v31.74,13.06
  Bottom 0.2: D10.A 24.64,15.06 24.64,12.66 26.94,10.36 29.29,10.36 31.74,12.81 v31.74,13.06
N$128  (via drill 0.3)
  Top 0.2: G.3 G.4 36.69,11.11 35.39,9.81 25.59,9.81 v25.54,9.86
  Bottom 0.2: v25.54,9.86 23.74,11.66 23.74,13.76 D11.A
N$129  (via drill 0.3)
  Top 0.2: G#.3 42.73,20.7 46.37,15.68 G#.4 45.39,13.76 v44.44,13.76
  Bottom 0.2: v44.44,13.76 44.84,13.36 D12.A
N$130  (via drill 0.3)
  Top 0.2: A.3 A.4 54.03,14.85 v53.34,14.16
  Bottom 0.2: D13.A 46.94,14.06 46.94,13.16 47.74,12.36 51.54,12.36 v53.34,14.16
N$131  (via drill 0.3)
  Top 0.2: A#.4 A#.3 47.44,26.83 47.01,27.03 44.18,24.99 44.18,20.03 44.34,19.86 v44.38,19.87
  Bottom 0.2: v44.38,19.87 44.38,19.23 45.14,18.46 45.14,17.96 D14.A
N$132  (via drill 0.3)
  Top 0.2: B.3 B.4 58.11,28.06 54.59,16.91 54.44,16.76 49.96,16.76 47.86,19.66 v46.74,19.66
  Bottom 0.2: D15.A v46.74,19.66
N$133  (via drill 0.3)
  Top 0.2: C.2.4 C.2.3 53.17,47.33 v52.24,48.26
  Bottom 0.2: D16.A 50.64,47.16 51.74,48.26 v52.24,48.26
Q0
  Bottom 0.2: R11.1 37.74,40.36 37.14,40.96 37.14,42.66 36.47,43.34 U5.2
Q1
  Bottom 0.2: R10.1 40.04,40.91 40.04,38.36 38.67,36.99 U5.7
Q2
  Bottom 0.2: R9.1 37.99,42.96 36.99,43.96 34.24,43.96 31.54,41.26 31.54,37.86 30.67,36.99 U5.10
Q3
  Bottom 0.2: R8.1 36.69,46.96 33.94,46.96 33.54,46.56 33.54,45.06 31.84,43.36 29.37,43.36 U5.15
R0
  Bottom 0.2: D4.K D5.K D6.K D7.K 16.34,30.76 16.74,30.36 16.74,29.66 17.41,29 U4.13
R1
  Bottom 0.2: D11.K D10.K D9.K D8.K 20.74,22.36 20.74,29.46 19.94,30.27 U4.14
R2
  Bottom 0.2: D12.K D13.K D14.K D15.K 47.24,20.96 25.14,20.96 21.14,24.96 21.14,29.66 19.27,31.54 U4.15
R3
  Bottom 0.2: D16.K 53.54,56.16 42.94,63.86 34.14,63.86 22.24,55.26 22.24,48.76 19.99,46.5 19.99,45.8 19.34,45.16 17.59,45.16 17.39,44.96 17.39,44.25 17.59,44.05 19.03,44.05 19.39,43.69 19.39,42.98 19.03,42.62 17.59,42.62 17.39,42.42 17.39,41.71 17.59,41.51 19.33,41.51 20.29,40.55 20.29,36.36 19.09,35.16 19.05,35.16 17.24,33.36 17.24,29.91 17.51,29.65 19.09,29.65 19.39,29.35 19.39,28.38 18.74,27.73 U4.12
TRIG
  Bottom 0.2: TRIG2EG.1 56.87,25.09 56.14,25.82 U6.6

### Text on the board
Top: S A T A N ' S / C Y C L E / W O R K S | KB | S C O R P I O
bPlace: S C O R P I O | KB
tStop: S A T A N ' S / C Y C L E / W O R K S | KB | S C O R P I O